# Altium schematic sheet G431.SchDoc
size A4; SheetNumber: 1; SheetTotal: 1
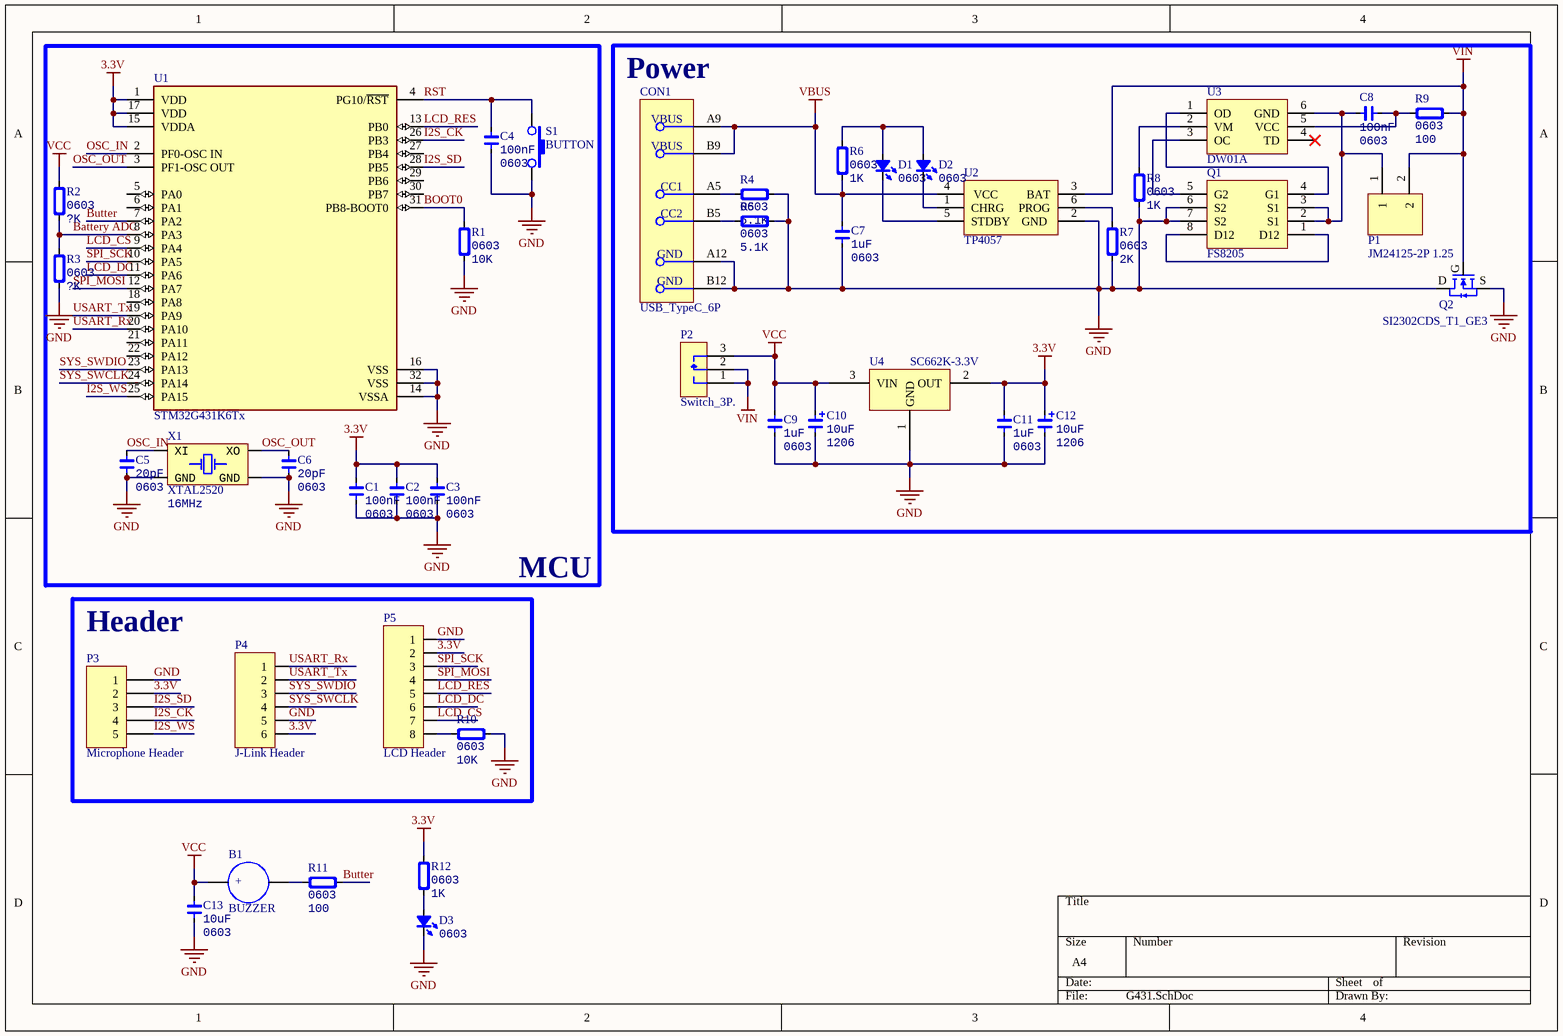
[diagram p0: G431.SchDoc]

## Parts
B1  BUZZER  [BUZZER - 5020]
C1  value 100nF  Type: 0603  [CAP_0603]  (hidden comment: C0603)
C2  value 100nF  Type: 0603  [CAP_0603]  (hidden comment: C0603)
C3  value 100nF  Type: 0603  [CAP_0603]  (hidden comment: C0603)
C4  value 100nF  Type: 0603  [CAP_0603]  (hidden comment: C0603)
C5  value 20pF  Type: 0603  [CAP_0603]  (hidden comment: C0603)
C6  value 20pF  Type: 0603  [CAP_0603]  (hidden comment: C0603)
C7  value 1uF  Type: 0603  [CAP_0603]  (hidden comment: C0603)
C8  value 100nF  Type: 0603  [CAP_0603]  (hidden comment: C0603)
C9  value 1uF  Type: 0603  [CAP_0603]  (hidden comment: C0603)
C10  value 10uF  Type: 1206  [CAP_TAN_CASE_A_BK]  (hidden comment: C1206)
C11  value 1uF  Type: 0603  [CAP_0603]  (hidden comment: C0603)
C12  value 10uF  Type: 1206  [CAP_TAN_CASE_A_BK]  (hidden comment: C1206)
C13  value 10uF  Type: 0603  [CAP_0603]  (hidden comment: C0603)
CON1  USB_TypeC_6P  [USB_TYPEC_6P]
D1  Type: 0603  [LED_0603_RED]  (hidden comment: D0603)
D2  Type: 0603  [LED_0603_RED]  (hidden comment: D0603)
D3  Type: 0603  [LED_0603_RED]  (hidden comment: D0603)
P1  JM24125-2P 1.25  [JM24125-2]
P2  Switch_3P.  [SWITCH_3PIN_90]
P3  Microphone Header  [ICS-43432 Pin]
P4  J-Link Header  [Pin Header 1.27mm 1x6]
P5  LCD Header  [Pin Header 2.54mm 1X8]
Q1  FS8205  [TSSOP8-1]
Q2  SI2302CDS_T1_GE3  [SOT23-3]
R1  value 10K  Type: 0603  [RES_0603]  (hidden comment: R0603)
R2  value ?K  Type: 0603  [RES_0603]  (hidden comment: R0603)
R3  value ?K  Type: 0603  [RES_0603]  (hidden comment: R0603)
R4  value 5.1K  Type: 0603  [RES_0603]  (hidden comment: R0603)
R5  value 5.1K  Type: 0603  [RES_0603]  (hidden comment: R0603)
R6  value 1K  Type: 0603  [RES_0603]  (hidden comment: R0603)
R7  value 2K  Type: 0603  [RES_0603]  (hidden comment: R0603)
R8  value 1K  Type: 0603  [RES_0603]  (hidden comment: R0603)
R9  value 100  Type: 0603  [RES_0603]  (hidden comment: R0603)
R10  value 10K  Type: 0603  [RES_0603]  (hidden comment: R0603)
R11  value 100  Type: 0603  [RES_0603]  (hidden comment: R0603)
R12  value 1K  Type: 0603  [RES_0603]  (hidden comment: R0603)
S1  BUTTON  [BUTTON - SMD]
U1  STM32G431K6Tx  [LQFP_P0.8_32]
U2  TP4057  [SOT23-6]
U3  DW01A  [SOT23-6-1]
U4  SC662K-3.3V  [SOT23-3]
X1  XTAL2520  value 16MHz  [XT_2520_4]

## Blocks framed on the sheet
MCU: C1-C6 R1-R3 S1 U1 X1
Power: C7-C12 CON1 D1 D2 P1 P2 Q1 Q2 R4-R9 U2-U4

## Nets
3.3V: C1.2 C2.2 C3.2 C11.1 C12.1 P3.2 P4.6 P5.2 R12.1 U1.1(VDD) U1.15(VDDA) U1.17(VDD) U4.2(OUT)
GND: C1.1 C2.1 C3.1 C4.2 C5.1 C6.1 C7.2 C9.2 C10.2 C11.2 C12.2 C13.2 CON1.A12(GND) CON1.B12(GND) D3.2(K) P3.1 P4.5 P5.1 Q1.6(S2) Q1.7(S2) Q2.2(S) Q2.3(D) R1.2 R3.1 R4.1 R5.1 R7.2 R8.2 R10.2 S1.2 U1.14(VSSA) U1.16(VSS) U1.32(VSS) U2.2(GND) U4.1(GND) X1.2(GND) X1.4(GND)
VBUS: C7.1 CON1.A9(VBUS) CON1.B9(VBUS) R6.2 U2.4(VCC)
VCC: B1.1 C9.1 C10.1 C13.1 P2.3 R2.2 U4.3(VIN)
VIN: P1.2 P2.1 P2.2 Q2.1(G) R9.2 U2.3(BAT)
Battery ADC: R2.1 R3.2 U1.8(PA3)
BOOT0: R1.1 U1.31(PB8-BOOT0)
Butter: R11.2 U1.7(PA2)
I2S_CK: P3.4 U1.26(PB3)
I2S_SD: P3.3 U1.28(PB5)
I2S_WS: P3.5 U1.25(PA15)
LCD_CS: P5.7 U1.9(PA4)
LCD_DC: P5.6 U1.11(PA6)
LCD_RES: P5.5 U1.13(PB0)
OSC_IN: C5.2 U1.2(PF0-OSC_IN) X1.1(XI)
OSC_OUT: C6.2 U1.3(PF1-OSC_OUT) X1.3(XO)
RST: C4.1 S1.1 U1.4(PG10/~{RST})
SPI_MOSI: P5.4 U1.12(PA7)
SPI_SCK: P5.3 U1.10(PA5)
SYS_SWCLK: P4.4 U1.24(PA14)
SYS_SWDIO: P4.3 U1.23(PA13)
USART_Rx: P4.1 U1.20(PA10)
USART_Tx: P4.2 U1.19(PA9)
NetB1_2: B1.2 R11.1
NetC8_1: C8.1 P1.1 Q1.2(S1) Q1.3(S1) U3.6(GND)
NetC8_2: C8.2 R9.1 U3.5(VCC)
NetCON1_A5: CON1.A5(CC1) R4.2
NetCON1_B5: CON1.B5(CC2) R5.2
NetD1_1: D1.1(A) D2.1(A) R6.1
NetD1_2: D1.2(K) U2.5(STDBY)
NetD2_2: D2.2(K) U2.1(CHRG)
NetD3_1: D3.1(A) R12.2
NetP5_8: P5.8 R10.1
NetQ1_1: Q1.1(D12) Q1.8(D12)
NetQ1_4: Q1.4(G1) U3.1(OD)
NetQ1_5: Q1.5(G2) U3.3(OC)
NetR7_1: R7.1 U2.6(PROG)
NetR8_1: R8.1 U3.2(VM)

Not connected (* = marked no-connect by the designer): U1 5(PA0) 6(PA1) 18(PA8) 21(PA11) 22(PA12) 27(PB4) 29(PB6) 30(PB7); U3 4(TD)*

## Notes on the sheet
- (near P3) Header
- (in symbol BUZZER) +

## Library data of the parts
C1-C9 C11 C13 = Cap_0603: Capacitor; Specification: X7R 50V; Manufacturer: *
C10 C12 = Cap_Tan_1206: Capacitor Tantalum; Specification: X5R 10V; Manufacturer: *
D1-D3 = LED_0603: LED; Manufacturer: *; Specification: *; Note: *
P1 = JM24125-2P 1.25: SMT 2P 1.25mm
P3 = ICS-43432 Pin
P4 = Header 6: Header
P5 = Header 8: Header
R1-R12 = Res_0603: Resistor; Specification: ±1%; Manufacturer: *
U1 = STM32G431K6Tx: MCU Mainstream Arm Cortex-M4 MCU 170 MHz 32 Kbytes of Flash Math Accel, Medium Analo
U2 = TP4057: Battery Charging IC 500 mA
U4 = SC662K-3.3V: LDO 300mA
X1 = XTAL_2520_4P: Crystal Oscillator; Type: XTAL2520_4P; Manufacturer: *; Note: *
B1 = BUZZER: ComponentLink1Description: buy 5020; ComponentLink1URL: https://item.taobao.com/item.htm?spm=a230r.1.14.16.1e3f6dc2uNnnc9&id=556098727646; ComponentLink2Description: datasheet - 5020; ComponentLink2URL: https://img.alicdn.com/imgextra/i3/2658592015/TB27gU.bfAPyuJjy0FcXXbCzpXa_!!2658592015.jpg